# EAGLE schematic pmpoi (EAGLE 7.5.0)
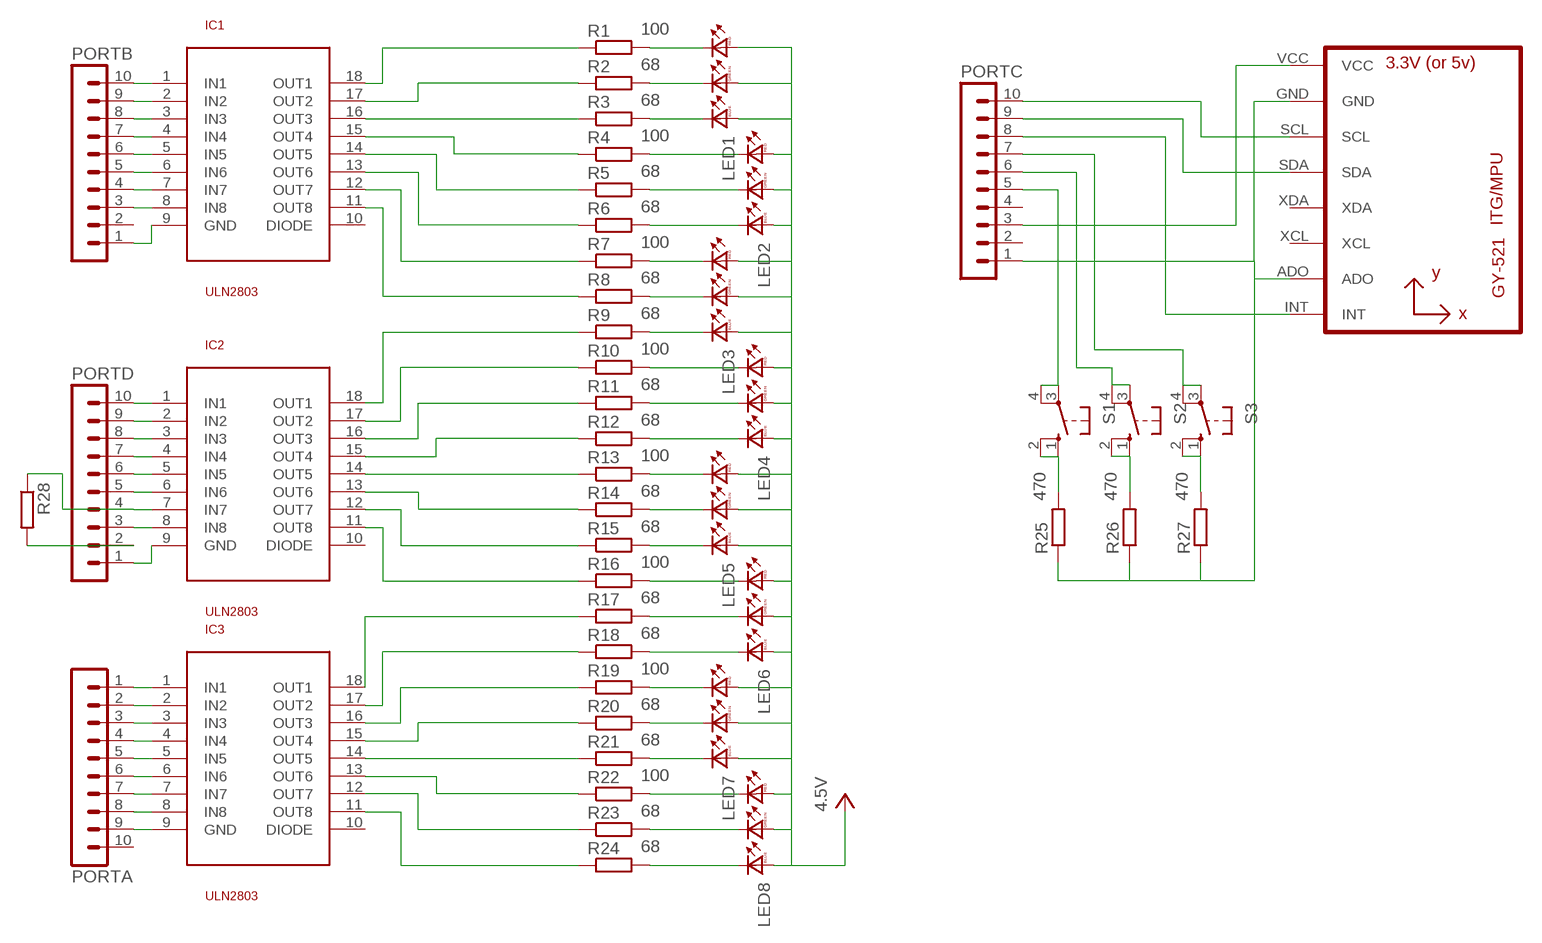
[diagram p0: schematic, sheet 1]

## Parts
IC1  ULN2803  [SO18L]
IC2  ULN2803  [SO18L]
IC3  ULN2803  [SO18L]
IC4  GY-521MPU6050  [GY-521]
LED1  F50360  [F50360]
LED2  F50360  [F50360]
LED3  F50360  [F50360]
LED4  F50360  [F50360]
LED5  F50360  [F50360]
LED6  F50360  [F50360]
LED7  F50360  [F50360]
LED8  F50360  [F50360]
PORTA  MA10-1  [MA10-1]
PORTB  MA10-1  [MA10-1]
PORTC  MA10-1  [MA10-1]
PORTD  MA10-1  [MA10-1]
R1  100  R0207/10  [0207/10]
R2  68  R0207/10  [0207/10]
R3  68  R0207/10  [0207/10]
R4  100  R0207/10  [0207/10]
R5  68  R0207/10  [0207/10]
R6  68  R0207/10  [0207/10]
R7  100  R0207/10  [0207/10]
R8  68  R0207/10  [0207/10]
R9  68  R0207/10  [0207/10]
R10  100  R0207/10  [0207/10]
R11  68  R0207/10  [0207/10]
R12  68  R0207/10  [0207/10]
R13  100  R0207/10  [0207/10]
R14  68  R0207/10  [0207/10]
R15  68  R0207/10  [0207/10]
R16  100  R0207/10  [0207/10]
R17  68  R0207/10  [0207/10]
R18  68  R0207/10  [0207/10]
R19  100  R0207/10  [0207/10]
R20  68  R0207/10  [0207/10]
R21  68  R0207/10  [0207/10]
R22  100  R0207/10  [0207/10]
R23  68  R0207/10  [0207/10]
R24  68  R0207/10  [0207/10]
R25  470  R0207/10  [0207/10]
R26  470  R0207/10  [0207/10]
R27  470  R0207/10  [0207/10]
R28  R0207/10  [0207/10]
S1  40-XX  [B3F-40XX]
S2  40-XX  [B3F-40XX]
S3  40-XX  [B3F-40XX]

## Nets
GND: IC1.9(GND) IC2.9(GND) IC3.9(GND) PORTA.9 PORTB.1 PORTD.1
N$1: IC1.18(OUT1) R1.1
N$2: IC1.17(OUT2) R2.1
N$3: IC1.16(OUT3) R3.1
N$4: IC1.15(OUT4) R4.1
N$5: IC1.14(OUT5) R5.1
N$6: IC1.13(OUT6) R6.1
N$7: IC1.12(OUT7) R7.1
N$8: IC2.18(OUT1) R9.1
N$9: IC1.11(OUT8) R8.1
N$10: IC2.17(OUT2) R10.1
N$11: IC2.16(OUT3) R11.1
N$12: IC2.15(OUT4) R12.1
N$13: IC2.14(OUT5) R13.1
N$14: IC2.13(OUT6) R14.1
N$15: IC2.12(OUT7) R15.1
N$16: IC2.11(OUT8) R16.1
N$17: IC3.15(OUT4) R20.1
N$18: IC3.16(OUT3) R19.1
N$19: IC3.18(OUT1) R17.1
N$20: IC3.11(OUT8) R24.1
N$21: IC3.12(OUT7) R23.1
N$22: IC3.13(OUT6) R22.1
N$23: IC3.17(OUT2) R18.1
N$24: IC3.14(OUT5) R21.1
N$25: LED1.BC R3.2
N$26: LED2.RC R4.2
N$27: LED2.GC R5.2
N$28: LED2.BC R6.2
N$29: LED3.RC R7.2
N$30: LED3.GC R8.2
N$31: LED3.BC R9.2
N$32: LED4.RC R10.2
N$33: LED4.GC R11.2
N$34: LED4.BC R12.2
N$35: LED5.RC R13.2
N$36: LED5.GC R14.2
N$37: LED5.BC R15.2
N$38: LED6.RC R16.2
N$39: LED6.BC R18.2
N$40: LED6.GC R17.2
N$41: LED7.RC R19.2
N$42: LED7.GC R20.2
N$43: LED7.BC R21.2
N$44: LED8.RC R22.2
N$45: LED8.GC R23.2
N$46: LED8.BC R24.2
N$47: IC4.VCC PORTC.3
N$48: LED1.GC R2.2
N$49: LED1.RC R1.2
N$50: IC2.8(IN8) PORTD.3
N$51: IC2.7(IN7) PORTD.4 R28.1
N$52: IC2.6(IN6) PORTD.5
N$53: IC2.5(IN5) PORTD.6
N$54: IC2.4(IN4) PORTD.7
N$55: IC2.3(IN3) PORTD.8
N$56: IC2.2(IN2) PORTD.9
N$57: IC2.1(IN1) PORTD.10
N$58: IC3.1(IN1) PORTA.1
N$59: IC3.2(IN2) PORTA.2
N$60: IC3.3(IN3) PORTA.3
N$61: IC3.4(IN4) PORTA.4
N$62: IC3.5(IN5) PORTA.5
N$63: IC3.6(IN6) PORTA.6
N$64: IC3.7(IN7) PORTA.7
N$65: IC3.8(IN8) PORTA.8
N$66: IC4.ADO IC4.GND PORTC.1 R25.1 R26.1 R27.1
N$67: IC1.8(IN8) PORTB.3
N$68: IC1.7(IN7) PORTB.4
N$69: IC1.6(IN6) PORTB.5
N$70: IC1.5(IN5) PORTB.6
N$71: IC1.4(IN4) PORTB.7
N$72: IC1.3(IN3) PORTB.8
N$73: IC1.2(IN2) PORTB.9
N$74: IC1.1(IN1) PORTB.10
N$75: IC4.SCL PORTC.10
N$76: IC4.SDA PORTC.9
N$77: R25.2 S1.1(S) S1.2(S1)
N$78: PORTC.7 S3.3(P) S3.4(P1)
N$79: PORTC.6 S2.3(P) S2.4(P1)
N$80: R26.2 S2.1(S) S2.2(S1)
N$81: R27.2 S3.1(S) S3.2(S1)
N$82: IC4.INT PORTC.8
N$83: PORTC.5 S1.3(P) S1.4(P1)
N$84: PORTD.2 R28.2
VCC: LED1.BA LED1.GA LED1.RA LED2.BA LED2.GA LED2.RA LED3.BA LED3.GA LED3.RA LED4.BA LED4.GA LED4.RA LED5.BA LED5.GA LED5.RA LED6.BA LED6.GA LED6.RA LED7.BA LED7.GA LED7.RA LED8.BA LED8.GA LED8.RA ; supply symbol labelled 4.5V
Unconnected: IC1.10(DIODE) IC2.10(DIODE) IC3.10(DIODE) IC4.XCL IC4.XDA PORTA.10 PORTB.2 PORTC.2 PORTC.4

## Library data of the parts
IC1-IC3 = uln2803:ULN2803
IC4 = gy-521:GY-521
LED1-LED8 = led:F50360: Full color Z-Power LED RGB P5-II Series Source: http://www.seoulsemicon.co.kr .. F50360.pdf
PORTA PORTB PORTC PORTD = con-lstb:MA10-1: PIN HEADER; OC_FARNELL: unknown; OC_NEWARK: unknown
R1-R28 = eagle-ltspice:R: RESISTOR, European symbol; SPICEMODEL: NONE; SPICEPREFIX: R
S1-S3 = switch-omron:40-XX: OMRON SWITCH; MF: OMRON COMPONENTS USA; MPN: B3F-4000; OC_FARNELL: 176434; OC_NEWARK: 36K3105